# EAGLE design FN_001 (EAGLE 9.5.0)
REV: 001
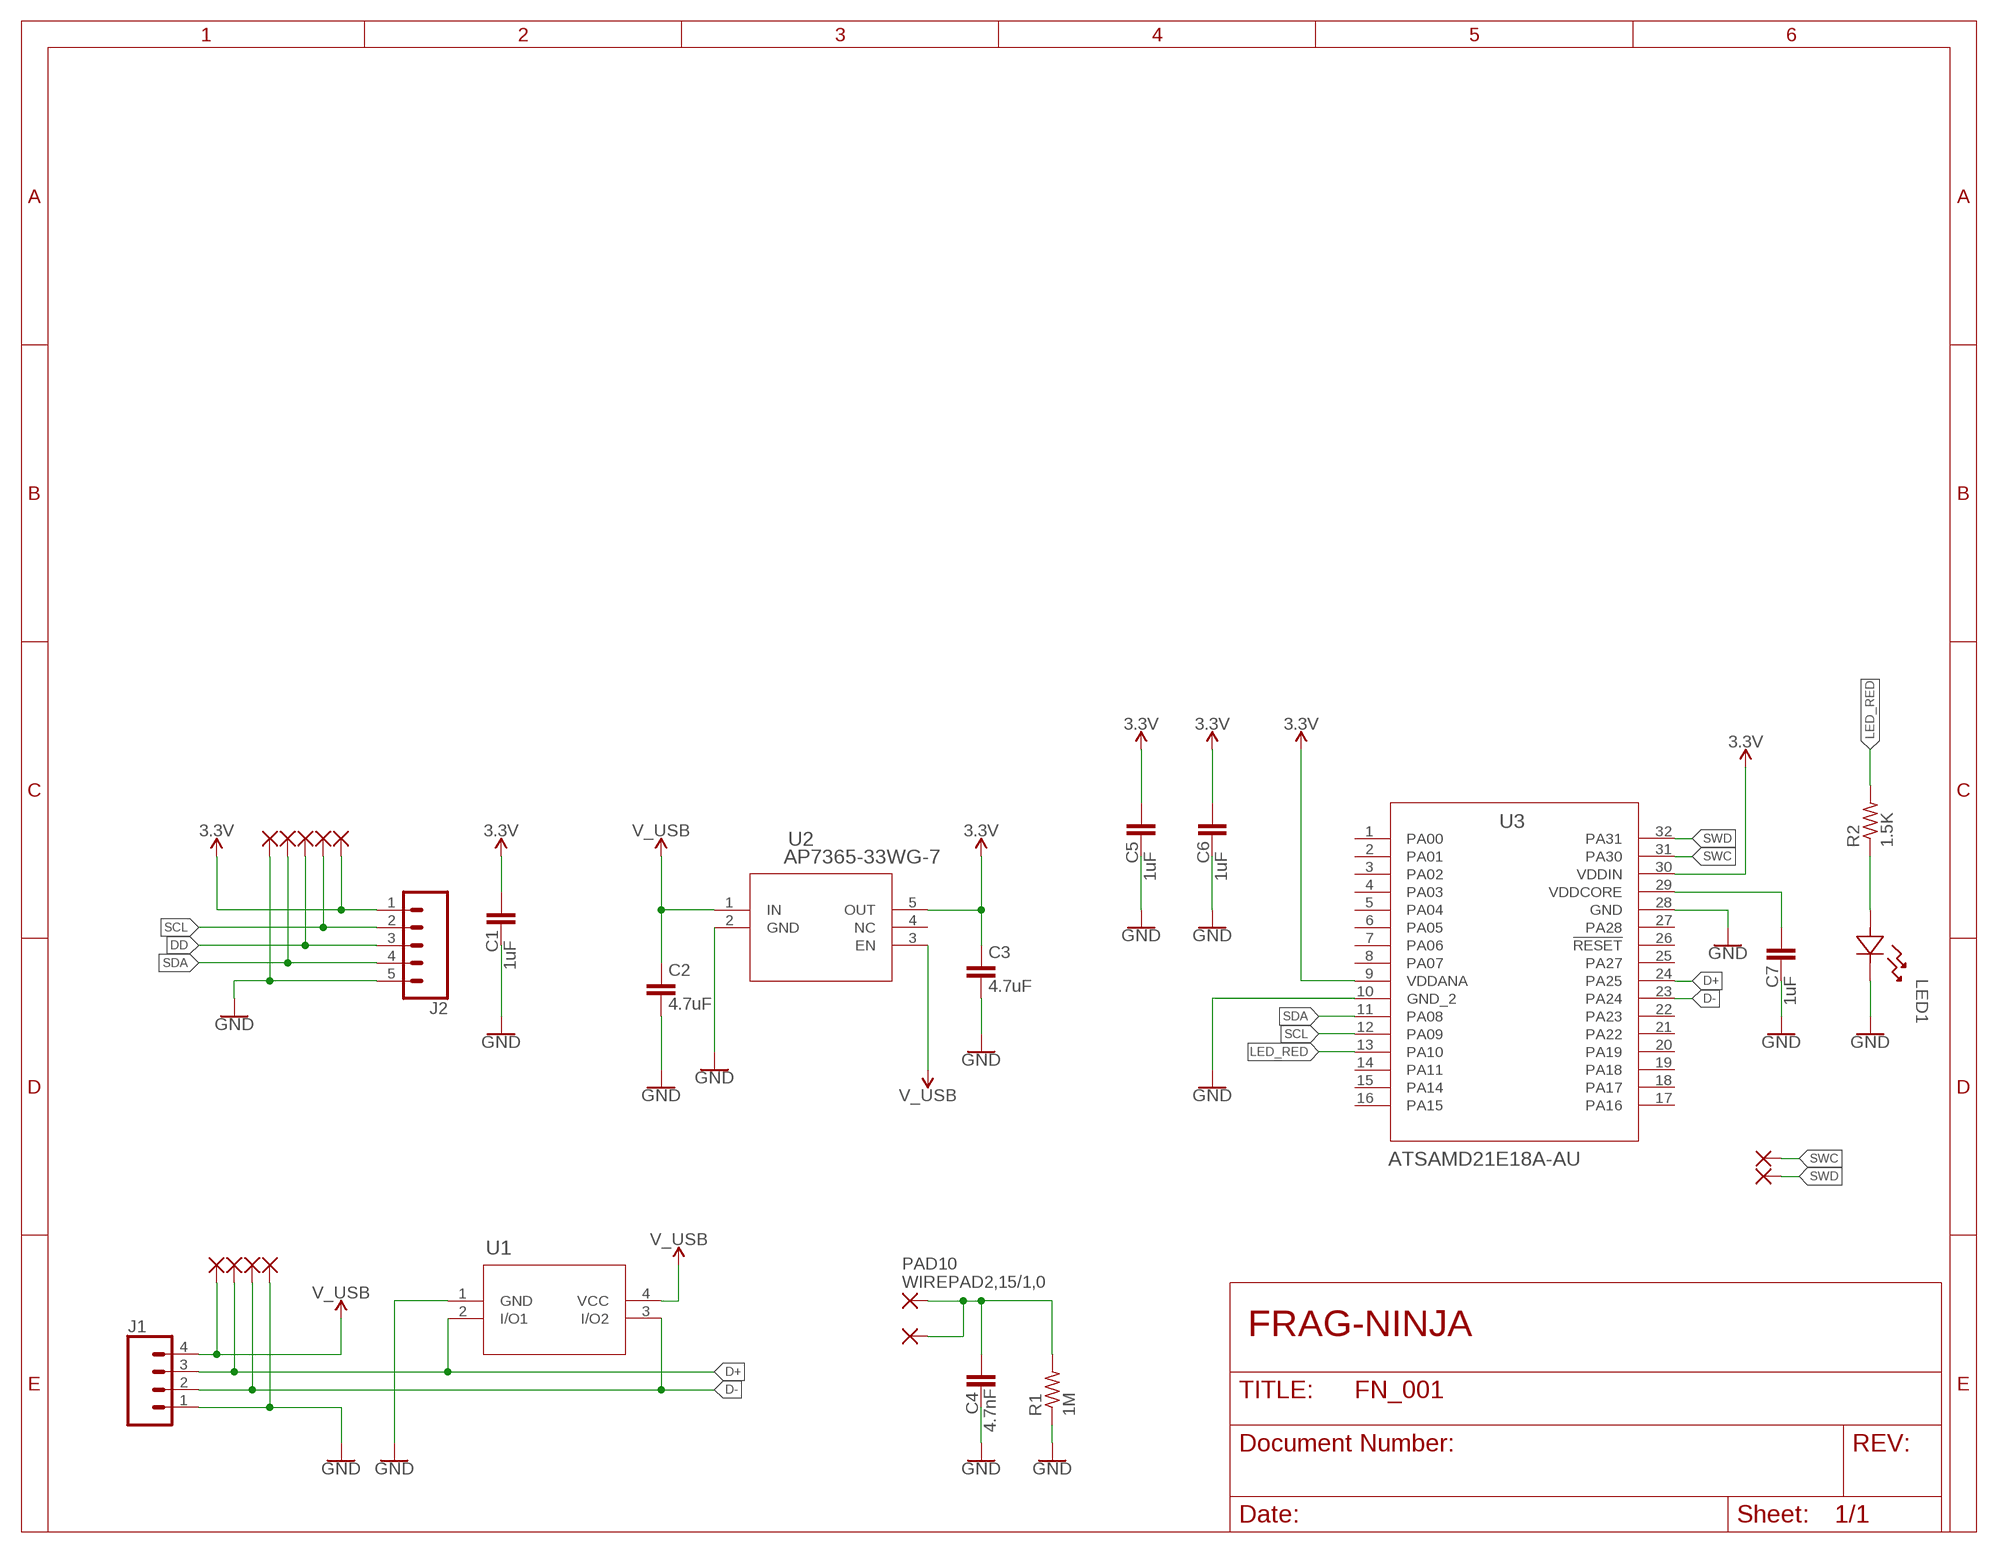
[diagram p0: schematic, sheet 1]

## Parts
C1  1uF  C-EUC0603K  [C0603K]
C2  4.7uF  C-EUC0603K  [C0603K]
C3  4.7uF  C-EUC0603K  [C0603K]
C4  4.7nF  C-EUC0603K  [C0603K]
C5  1uF  C-EUC0603K  [C0603K]
C6  1uF  C-EUC0603K  [C0603K]
C7  1uF  C-EUC0603K  [C0603K]
J1  CONN_04PTH  [1X04]
J2  CONN_05  [1X05]
LED1  SML-D12U1WT86  [LED_SMLD12_ROM]
PAD1  WIREPADSMD1,27-254  [SMD1,27-2,54]
PAD2  WIREPADSMD1,27-254  [SMD1,27-2,54]
PAD3  WIREPADSMD1,27-254  [SMD1,27-2,54]
PAD4  WIREPADSMD1,27-254  [SMD1,27-2,54]
PAD5  WIREPADSMD1,27-254  [SMD1,27-2,54]
PAD6  WIREPADSMD1,27-254  [SMD1,27-2,54]
PAD7  WIREPADSMD1,27-254  [SMD1,27-2,54]
PAD8  WIREPADSMD1,27-254  [SMD1,27-2,54]
PAD9  WIREPADSMD1,27-254  [SMD1,27-2,54]
PAD10  WIREPAD2,15/1,0  [2,15/1,0]
PAD11  WIREPADSMD2,54-5,08  [SMD2,54-5,08]
PAD12  WIREPADSMD1,27-254  [SMD1,27-2,54]
PAD13  WIREPADSMD1,27-254  [SMD1,27-2,54]
R1  1M  R-US_R0603  [R0603]
R2  1.5K  R-US_R0603  [R0603]
U1  PRTR5V0U2X  [SOT143B_NXP]
U2  AP7365-33WG-7  [SOT25_DIO]
U3  ATSAMD21E18A-AU  [TQFP32_MC_MCH]

## Nets
3.3V: C1.1 C3.1 C5.1 C6.1 J2.1 PAD9.1(P) U2.5(OUT) U3.9(VDDANA) U3.30(VDDIN)
D+: J1.3 PAD2.1(P) U1.2(I/O1) U3.24(PA25)
D-: J1.2 PAD3.1(P) U1.3(I/O2) U3.23(PA24)
DD: J2.3 PAD7.1(P)
GND: C1.2 C2.2 C3.2 C4.2 C5.2 C6.2 C7.2 J1.1 J2.5 LED1.1 PAD4.1(P) PAD5.1(P) R1.1 U1.1(GND) U2.2(GND) U3.10(GND_2) U3.28(GND)
LED_RED: R2.2 U3.13(PA10)
N$1: LED1.2 R2.1
N$2: C4.1 PAD10.1(P) PAD11.1(P) R1.2
N$6: C7.1 U3.29(VDDCORE)
SCL: J2.2 PAD8.1(P) U3.12(PA09)
SDA: J2.4 PAD6.1(P) U3.11(PA08)
SWC: PAD12.1(P) U3.31(PA30)
SWD: PAD13.1(P) U3.32(PA31)
V_USB: C2.1 J1.4 PAD1.1(P) U1.4(VCC) U2.1(IN) U2.3(EN)
Unconnected: U2.4(NC) U3.1(PA00) U3.2(PA01) U3.3(PA02) U3.4(PA03) U3.5(PA04) U3.6(PA05) U3.7(PA06) U3.8(PA07) U3.14(PA11) U3.15(PA14) U3.16(PA15) U3.17(PA16) U3.18(PA17) U3.19(PA18) U3.20(PA19) U3.21(PA22) U3.22(PA23) U3.25(PA27) U3.26(!RESET) U3.27(PA28)

## Notes on the sheet
- FRAG-NINJA

## Library data of the parts
C1-C7 = rcl:C-EU: CAPACITOR, European symbol; SPICEPREFIX: C
J1 = SparkFun-Connectors:CONN_04: Multi connection point. Often used as Generic Header-pin footprint for 0.1 inch spaced/style header connections On any of the 0.1 inch spaced packages, you can populate with these: Break Away Headers - Straight <https://www.sparkfun.com/products/116> (PRT-00116) Break Away Male Headers - Right Angle <https://www.sparkfun.com/products/553> (PRT-00553) Female Headers <https://www.sparkfun.com/products/115> (PRT-00115) Break Away Headers - Machine Pin <https://www.sparkfun.com/products/117> (PRT-00117) Break Away Female Headers - Swiss Machine Pin <https://www.sparkfun.com/products/743> (PRT-00743) For SCREWTERMINALS and SPRING TERMINALS visit here: Screw Terimnals on SparkFun.com <https://www.sparkfun.com/search/results?term=Screw+Terminals> (5mm/3.5mm/2.54mm spacing) This device is also useful as a general connection point to wire up your design to another part of your project. Our various solder wires solder well into these plated through hole pads. Hook-Up Wire - Assortment (Stranded, 22 AWG) <https://www.sparkfun.com/products/11375> (PRT-11375) Hook-Up Wire - Assortment (Solid Core, 22 AWG) <https://www.sparkfun.com/products/11367> (PRT-11367) View the entire wire category on our website here <https://www.sparkfun.com/categories/141> Special notes: Molex polarized connector foot print use with SKU : PRT-08231 with associated crimp pins and housings. 1MM SMD Version SKU: PRT-10208; PROD_ID: CONN-09696
J2 = SparkFun-Connectors:CONN_05: Multi connection point. Often used as Generic Header-pin footprint for 0.1 inch spaced/style header connections On any of the 0.1 inch spaced packages, you can populate with these: Break Away Headers - Straight <https://www.sparkfun.com/products/116> (PRT-00116) Break Away Male Headers - Right Angle <https://www.sparkfun.com/products/553> (PRT-00553) Female Headers <https://www.sparkfun.com/products/115> (PRT-00115) Break Away Headers - Machine Pin <https://www.sparkfun.com/products/117> (PRT-00117) Break Away Female Headers - Swiss Machine Pin <https://www.sparkfun.com/products/743> (PRT-00743) For SCREWTERMINALS and SPRING TERMINALS visit here: Screw Terimnals on SparkFun.com <https://www.sparkfun.com/search/results?term=Screw+Terminals> (5mm/3.5mm/2.54mm spacing) This device is also useful as a general connection point to wire up your design to another part of your project. Our various solder wires solder well into these plated through hole pads. Hook-Up Wire - Assortment (Stranded, 22 AWG) <https://www.sparkfun.com/products/11375> (PRT-11375) Hook-Up Wire - Assortment (Solid Core, 22 AWG) <https://www.sparkfun.com/products/11367> (PRT-11367) View the entire wire category on our website here <https://www.sparkfun.com/categories/141> Special notes: Molex polarized connector foot print use with SKU : PRT-08231 with associated crimp pins and housings. 1MM SMD Version SKU: PRT-10208
LED1 = SML-D12U1WT86:SML-D12U1WT86; BUILT_BY: EMA_Matt; COPYRIGHT: Copyright (C) 2018 Accelerated Designs. All rights reserved; MANUFACTURER_PART_NUMBER: SML-D12U1WT86; SOURCELIBRARY: Rohm_2019-09-23; VENDOR: ROHM Semiconductor
PAD1-PAD13 = wirepad:WIREPAD: Wire PAD connect wire on PCB
R1 R2 = rcl:R-US_: RESISTOR, American symbol; SPICEPREFIX: R
U1 = PRTR5V0U2X:PRTR5V0U2X; BUILT_BY: EMA_UL_Team; MANUFACTURER_PART_NUMBER: PRTR5V0U2X; SOURCELIBRARY: NXP_2011-11-10; VENDOR: NXP
U2 = AP7365-33WG-7:AP7365-33WG-7; BUILT_BY: EMA_UL_Team; MANUFACTURER_PART_NUMBER: AP7365-33WG-7; SOURCELIBRARY: DIODESINC_2_2015-08-18; VENDOR: Diodes Inc
U3 = ATSAMD21E18A-AU:ATSAMD21E18A-AU; BUILT_BY: EMA_Molly; COPYRIGHT: Copyright (C) 2018 Accelerated Designs. All rights reserved; MANUFACTURER_PART_NUMBER: ATSAMD21E18A-AU; SOURCELIBRARY: Microchip_2019-08-23_25; VENDOR: Microchip

## Board
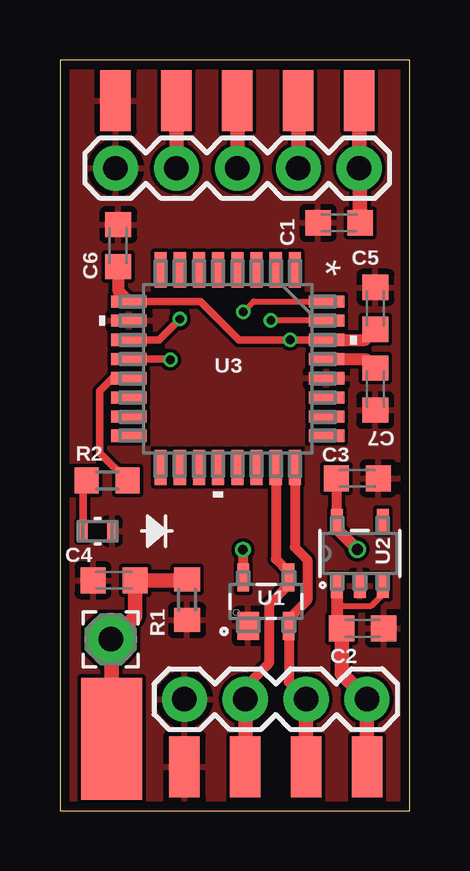
[diagram p1: board, top side]
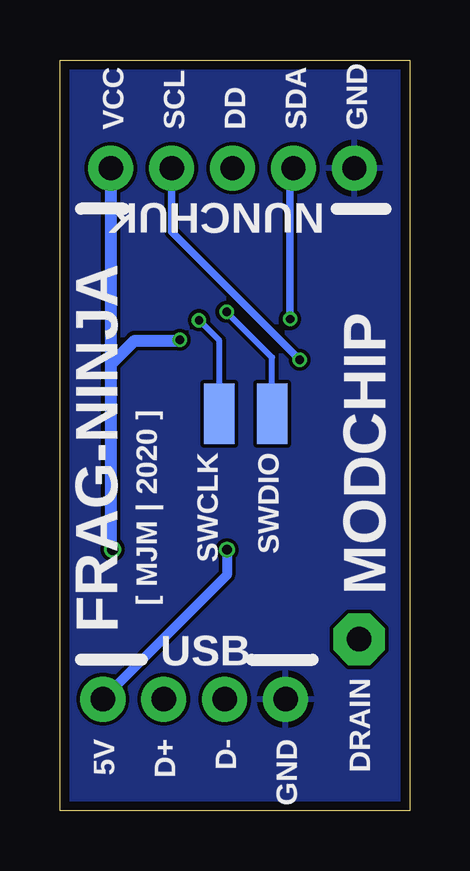
[diagram p2: board, bottom side, seen from below]

Size 14.6 x 31.3 mm. Coordinates in mm from the lower left corner, seen from the top.
Outline: 0,0 14.6,0 14.6,31.3 0,31.3 0,0
Copper layers (1*16): Top 0.035559375mm / dielectric 1.6mm / Bottom 0.035559375mm
Design rules "oshpark-2layer": minimum track width 6mil, minimum drill 10mil, track to track 6mil, track to pad 6mil, pad to pad 6mil, via to via 6mil, smd to smd 6mil, copper to edge 15mil, drill to drill 6mil, minimum pad ring 5mil, minimum via ring 5mil, stop-mask expansion 2.5mil, vias tented up to drill 0mil, thermal gap 10mil

### Footprints (pad centres in the part's own frame; a part is rotated, then mirrored left to right if it is on the bottom)
C0603K = smd 1.05 x 1.08: 1 -0.875,0; 2 0.875,0
1X04 = drill 1.016 pad 1.88: 1 0,0; 2 2.54,0; 3 5.08,0; 4 7.62,0
1X05 = drill 1.016 pad 1.88: 1 0,0; 2 2.54,0; 3 5.08,0; 4 7.62,0; 5 10.16,0
LED_SMLD12_ROM = smd 0.394 x 0.813: 1 -0.603,0; 2 0.603,0
SMD1,27-2,54 = smd 1.27 x 2.54: 1 0,0
2,15/1,0 = drill 1.016 pad 2.159 octagon: 1 0,0
SMD2,54-5,08 = smd 2.54 x 5.08: 1 0,0
R0603 = smd 1 x 1.1: 1 -0.85,0; 2 0.85,0
SOT143B_NXP = smd 0.889 x 1.168: 1 -0.747,-1.016 | smd 0.483 x 1.168: 2 0.95,-1.016; 3 0.95,1.016; 4 -0.95,1.016
SOT25_DIO = smd 1.006 x 0.5: 1 -1.353,0.95; 2 -1.353,0; 3 -1.353,-0.95; 4 1.353,-0.95; 5 1.353,0.95
TQFP32_MC_MCH = smd 1.473 x 0.508: 1 -4.119,2.8; 2 -4.119,2; 3 -4.119,1.2; 4 -4.119,0.4; 5 -4.119,-0.4; 6 -4.119,-1.2; 7 -4.119,-2; 8 -4.119,-2.8; 17 4.119,-2.8; 18 4.119,-2; 19 4.119,-1.2; 20 4.119,-0.4; 21 4.119,0.4; 22 4.119,1.2; 23 4.119,2; 24 4.119,2.8 | smd 0.508 x 1.473: 9 -2.8,-4.119; 10 -2,-4.119; 11 -1.2,-4.119; 12 -0.4,-4.119; 13 0.4,-4.119; 14 1.2,-4.119; 15 2,-4.119; 16 2.8,-4.119; 25 2.8,4.119; 26 2,4.119; 27 1.2,4.119; 28 0.4,4.119; 29 -0.4,4.119; 30 -1.2,4.119; 31 -2,4.119; 32 -2.8,4.119

### Placement (x,y rotation side)
C1  11.64,24.51 180 top
C2  12.62,7.6 0 top
C3  12.4,13.86 0 top
C4  2.25,9.61 180 top
C5  13.16,20.95 90 top
C6  2.43,23.55 90 top
C7  13.15,17.59 270 top
J1  5.19,4.65 0 top
J2  12.48,26.79 180 top
LED1  1.57,11.66 180 top
PAD1  12.81,1.84 0 top
PAD2  10.27,1.84 0 top
PAD3  7.73,1.84 0 top
PAD4  2.32,29.6 0 top
PAD5  5.19,1.84 0 top
PAD6  4.86,29.6 0 top
PAD7  7.4,29.6 0 top
PAD8  9.94,29.6 0 top
PAD9  12.48,29.6 0 top
PAD10  2.12,7.15 0 top
PAD11  2.16,2.99 0 top
PAD12  7.95,16.55 180 bottom
PAD13  5.75,16.55 0 bottom
R1  5.3,8.8 90 top
R2  1.97,13.77 0 top
U1  8.6,8.72 0 top
U2  12.51,10.73 90 top
U3  7,18.43 270 top

### Tracks (layer width: path | path; a pad name or v marks a point on that pad's centre or on a via)
3.3V  (via drill 0.35, 0.45)
  Top 0.305: U3.9 5.87,21.23 7.47,19.63 v9.6,19.63 U3.30
  Top 0.406: C3.1 11.53,13.76 11.56,13.73 U2.5
  Top 0.508: U3.30 12.72,19.63 C5.1 | C6.1 2.43,21.68 U3.9 | v12.4,10.9 11.56,11.74 U2.5
  Top 0.61: PAD9.1 J2.1 12.52,26.75 C1.1
  Bottom 0.305: 9.6,19.6 v9.6,19.63
  Bottom 0.508: J2.1 12.48,18.6 | 12.48,18.6 11.48,19.6 9.6,19.6 | 12.48,18.6 12.48,10.98 v12.4,10.9
D+
  Top 0.406: J1.3 9.55,5.37 U1.2 9.55,8 10.32,8.78 10.32,10.46 9.8,10.98 U3.24
  Top 0.61: PAD2.1 J1.3
D-
  Top 0.406: J1.2 7.73,5.17 8.73,6.17 8.73,8.61 9.55,9.43 U1.3 9.55,9.94 9,10.49 U3.23
  Top 0.61: PAD3.1 J1.2
DD
  Top 0.61: PAD7.1 J2.3
GND
  pour Top (rank 6): -1.7,33 15.9,33 15.9,-1.1 -1.7,-1.1
  pour Bottom (rank 6): -1.3,32.6 16.4,32.6 16.4,-1.5 -1.3,-1.5
LED_RED
  Top 0.305: U3.13 2.19,18.03 1.67,17.5 1.67,14.92 R2.2
N$1
  Top 0.305: LED1.2 0.97,13.62 R2.1
N$2
  Top 0.61: PAD11.1 2.16,7.11 | 2.16,7.11 PAD10.1 | 2.16,7.11 3.13,8.08 C4.1 5.26,9.61 R1.2
N$6
  Top 0.508: U3.29 12.78,18.83 C7.1
SCL  (via drill 0.35)
  Top 0.305: U3.12 4.57,18.83 v4.6,18.8
  Top 0.61: PAD8.1 J2.2
  Bottom 0.305: v4.6,18.8 9.94,24.14 J2.2
SDA  (via drill 0.35)
  Top 0.305: U3.11 4.13,19.63 v5,20.5
  Top 0.61: PAD6.1 J2.4
  Bottom 0.305: v5,20.5 5,26.65 J2.4
SWC  (via drill 0.35)
  Top 0.254: U3.31 8.82,20.43 v8.8,20.45
  Bottom 0.254: PAD12.1 7.95,19.6 v8.8,20.45
SWD  (via drill 0.35)
  Top 0.254: v7.65,20.8 8.08,21.23 U3.32
  Bottom 0.254: PAD13.1 5.75,18.9 v7.65,20.8
V_USB  (via drill 0.4)
  Top 0.254: 11.56,8.54 12.99,8.54 13.46,9.01 U2.3
  Top 0.406: U1.4 7.65,10.86 v7.63,10.88
  Top 0.508: U2.1 11.56,8.54 11.56,7.79 C2.1
  Top 0.61: PAD1.1 J1.4 11.75,5.71 C2.1
  Bottom 0.406: v7.63,10.88 7.63,9.83 J1.4

### Text on the board
bPlace: GND | SDA | DD | SCL | VCC | NUNCHUK | FRAG-NINJA | MODCHIP | [ MJM | 2020 ] | SWDIO | SWCLK | DRAIN | USB | GND | D- | D+ | 5V